# Altium schematic sheet SunS_MCU.SchDoc
size A2
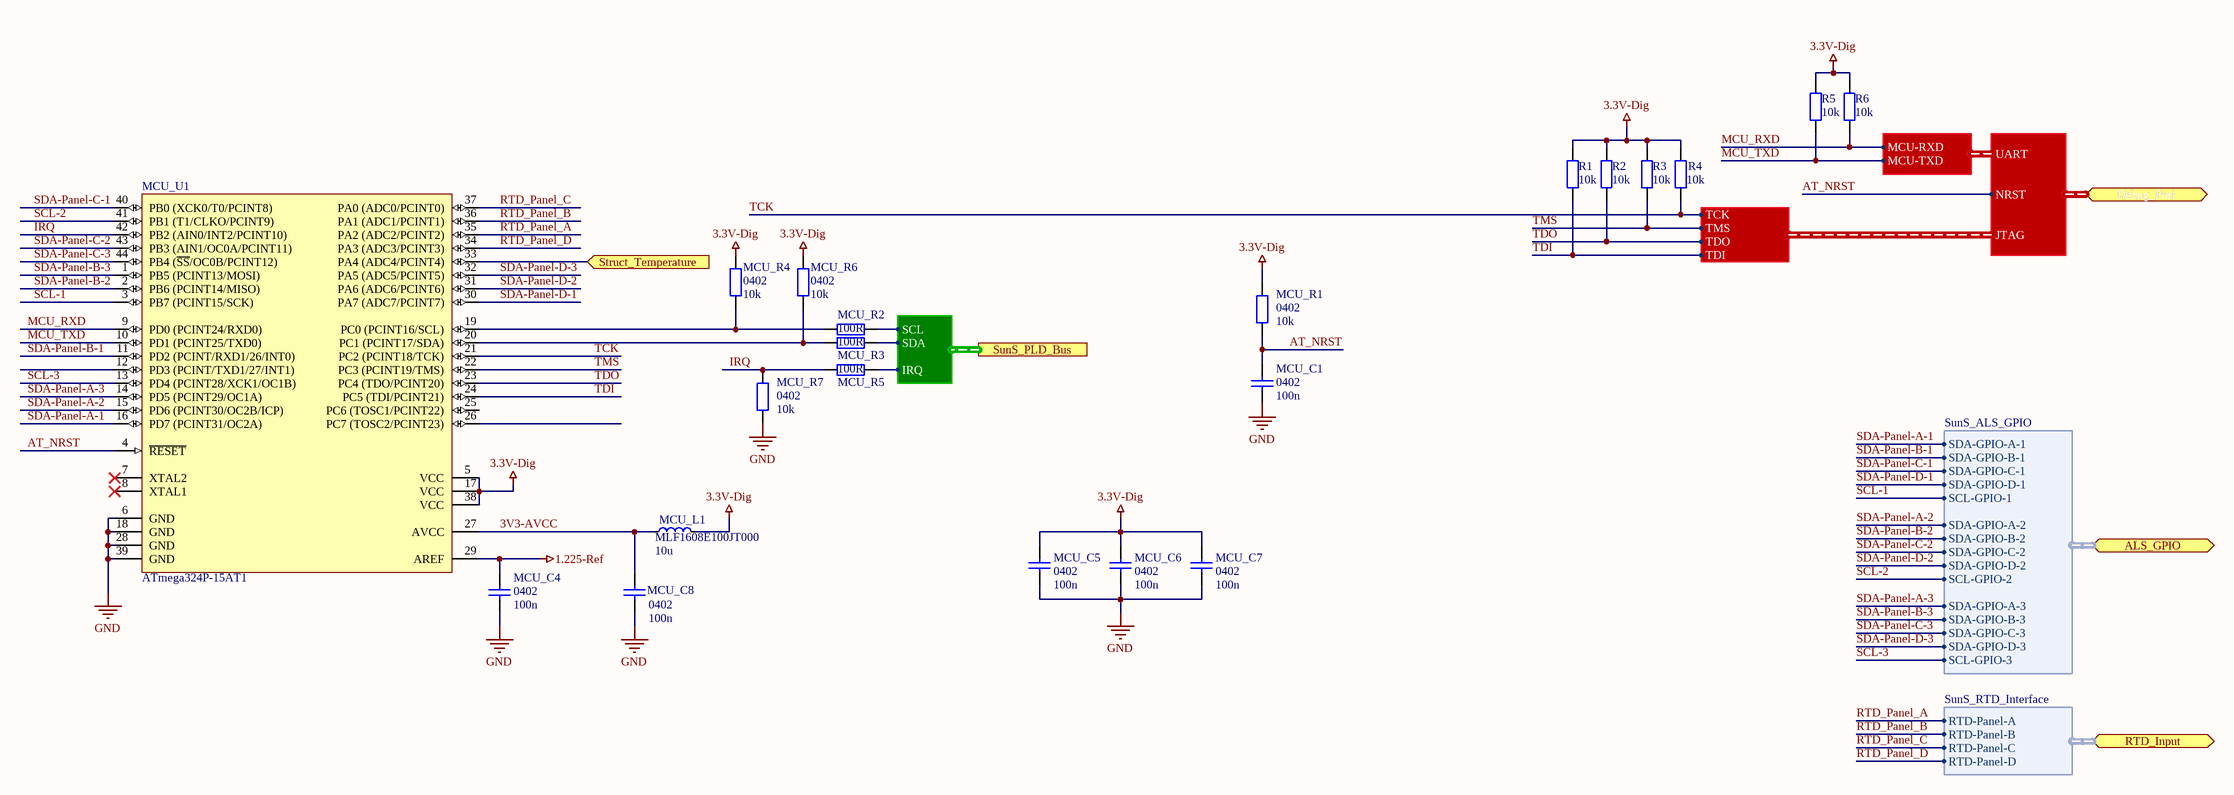
[diagram p0: SunS_MCU.SchDoc]

## Parts
MCU_C1  0402  value 100n  [SMD_Capacitor_0402]
MCU_C4  0402  value 100n  [SMD_Capacitor_0402]
MCU_C5  0402  value 100n  [SMD_Capacitor_0402]
MCU_C6  0402  value 100n  [SMD_Capacitor_0402]
MCU_C7  0402  value 100n  [SMD_Capacitor_0402]
MCU_C8  0402  value 100n  [SMD_Capacitor_0402]
MCU_L1  Manufacturer Part Number: MLF1608E100JT000  [0603]  (hidden comment: 10u)
MCU_R1  0402  value 10k  [SMD_Capacitor_0402]
MCU_R2  100R  [SMD_Resistor_0402]
MCU_R3  100R  [SMD_Resistor_0402]
MCU_R4  0402  value 10k  [SMD_Capacitor_0402]
MCU_R5  100R  [SMD_Resistor_0402]
MCU_R6  0402  value 10k  [SMD_Capacitor_0402]
MCU_R7  0402  value 10k  [SMD_Capacitor_0402]
MCU_U1  ATmega324P-15AT1  [TQFP-44]
R1  10k  [SMD_Resistor_0402]
R2  10k  [SMD_Resistor_0402]
R3  10k  [SMD_Resistor_0402]
R4  10k  [SMD_Resistor_0402]
R5  10k  [SMD_Resistor_0402]
R6  10k  [SMD_Resistor_0402]

## Ports
ALS_GPIO (harness SunS_ALS_GPIO), Debug_Port (harness SunS-Debug-Port), RTD_Input (harness SunS_RTD_Interface), Struct_Temperature (in), SunS_PLD_Bus (harness SunS_PLD_Bus)

## Harnesses
SunS_RTD_Interface: RTD-Panel-A, RTD-Panel-B, RTD-Panel-C, RTD-Panel-D
SunS-UART: MCU-RXD, MCU-TXD
SunS-Debug-Port: NRST, UART, JTAG
SunS_ALS_GPIO: SDA-GPIO-A-1, SDA-GPIO-D-1, SDA-GPIO-B-1, SDA-GPIO-C-1, SCL-GPIO-1, SDA-GPIO-A-2, SDA-GPIO-D-2, SDA-GPIO-B-2, SDA-GPIO-C-2, SCL-GPIO-2, SDA-GPIO-A-3, SDA-GPIO-D-3, SDA-GPIO-B-3, SDA-GPIO-C-3, SCL-GPIO-3
SunS_PLD_Bus: SCL, SDA, IRQ
JTAG: TDO, TDI, TMS, TCK

## Nets
1.225-Ref: MCU_C4.2 MCU_U1.29(AREF)
3.3V-Dig: MCU_C5.2 MCU_C6.2 MCU_C7.2 MCU_L1.2 MCU_R1.2 MCU_R4.2 MCU_R6.2 MCU_U1.5(VCC) MCU_U1.17(VCC) MCU_U1.38(VCC) R1.1 R2.1 R3.1 R4.1 R5.1 R6.1
GND: MCU_C1.1 MCU_C4.1 MCU_C5.1 MCU_C6.1 MCU_C7.1 MCU_C8.1 MCU_R7.1 MCU_U1.6(GND) MCU_U1.18(GND) MCU_U1.28(GND) MCU_U1.39(GND)
3V3-AVCC: MCU_C8.2 MCU_L1.1 MCU_U1.27(AVCC)
AT_NRST: MCU_C1.2 MCU_R1.1 MCU_U1.4(~{RESET}) ; port Debug_Port.NRST
IRQ: MCU_R5.1 MCU_R7.2 MCU_U1.42(PB2_(AIN0/INT2/PCINT10))
MCU_RXD: MCU_U1.9(PD0_(PCINT24/RXD0)) R6.2 ; harness SunS-UART.MCU-RXD
MCU_TXD: MCU_U1.10(PD1_(PCINT25/TXD0)) R5.2 ; harness SunS-UART.MCU-TXD
RTD_Panel_A: MCU_U1.35(PA2_(ADC2/PCINT2)) ; port RTD_Input.RTD-Panel-A
RTD_Panel_B: MCU_U1.36(PA1_(ADC1/PCINT1)) ; port RTD_Input.RTD-Panel-B
RTD_Panel_C: MCU_U1.37(PA0_(ADC0/PCINT0)) ; port RTD_Input.RTD-Panel-C
RTD_Panel_D: MCU_U1.34(PA3_(ADC3/PCINT3)) ; port RTD_Input.RTD-Panel-D
SCL-1: MCU_U1.3(PB7_(PCINT15/SCK)) ; port ALS_GPIO.SCL-GPIO-1
SCL-2: MCU_U1.41(PB1_(T1/CLKO/PCINT9)) ; port ALS_GPIO.SCL-GPIO-2
SCL-3: MCU_U1.13(PD4_(PCINT28/XCK1/OC1B)) ; port ALS_GPIO.SCL-GPIO-3
SDA-Panel-A-1: MCU_U1.16(PD7_(PCINT31/OC2A)) ; port ALS_GPIO.SDA-GPIO-A-1
SDA-Panel-A-2: MCU_U1.15(PD6_(PCINT30/OC2B/ICP)) ; port ALS_GPIO.SDA-GPIO-A-2
SDA-Panel-A-3: MCU_U1.14(PD5_(PCINT29/OC1A)) ; port ALS_GPIO.SDA-GPIO-A-3
SDA-Panel-B-1: MCU_U1.11(PD2_(PCINT/RXD1/26/INT0)) ; port ALS_GPIO.SDA-GPIO-B-1
SDA-Panel-B-2: MCU_U1.2(PB6_(PCINT14/MISO)) ; port ALS_GPIO.SDA-GPIO-B-2
SDA-Panel-B-3: MCU_U1.1(PB5_(PCINT13/MOSI)) ; port ALS_GPIO.SDA-GPIO-B-3
SDA-Panel-C-1: MCU_U1.40(PB0_(XCK0/T0/PCINT8)) ; port ALS_GPIO.SDA-GPIO-C-1
SDA-Panel-C-2: MCU_U1.43(PB3_(AIN1/OC0A/PCINT11)) ; port ALS_GPIO.SDA-GPIO-C-2
SDA-Panel-C-3: MCU_U1.44(PB4_(~{SS}/OC0B/PCINT12)) ; port ALS_GPIO.SDA-GPIO-C-3
SDA-Panel-D-1: MCU_U1.30(PA7_(ADC7/PCINT7)) ; port ALS_GPIO.SDA-GPIO-D-1
SDA-Panel-D-2: MCU_U1.31(PA6_(ADC6/PCINT6)) ; port ALS_GPIO.SDA-GPIO-D-2
SDA-Panel-D-3: MCU_U1.32(PA5_(ADC5/PCINT5)) ; port ALS_GPIO.SDA-GPIO-D-3
Struct_Temperature: MCU_U1.33(PA4_(ADC4/PCINT4)) ; port Struct_Temperature
TCK: MCU_U1.21(PC2_(PCINT18/TCK)) R4.2 ; harness JTAG.TCK
TDI: MCU_U1.24(PC5_(TDI/PCINT21)) R1.2 ; harness JTAG.TDI
TDO: MCU_U1.23(PC4_(TDO/PCINT20)) R2.2 ; harness JTAG.TDO
TMS: MCU_U1.22(PC3_(PCINT19/TMS)) R3.2 ; harness JTAG.TMS
NetMCU_R2_1: MCU_R2.1 MCU_R4.1 MCU_U1.19(PC0_(PCINT16/SCL))
NetMCU_R2_2: MCU_R2.2 ; port SunS_PLD_Bus.SCL
NetMCU_R3_1: MCU_R3.1 MCU_R6.1 MCU_U1.20(PC1_(PCINT17/SDA))
NetMCU_R3_2: MCU_R3.2 ; port SunS_PLD_Bus.SDA
NetMCU_R5_2: MCU_R5.2 ; port SunS_PLD_Bus.IRQ

Not connected (* = marked no-connect by the designer): MCU_U1 7(XTAL2)* 8(XTAL1)* 12(PD3_(PCINT/TXD1/27/INT1)) 25(PC6_(TOSC1/PCINT22)) 26(PC7_(TOSC2/PCINT23))

## Notes on the sheet
- Title:
- Project:
- Author:
- Model:
- File name:
- Document Number:
- Checked by:
- Rev:
- Date:
- Approved by:
- Sheet:
- of

## Library data of the parts
MCU_C1 MCU_C4-MCU_C8 = Cap: Capacitor; Published: 8-Jun-2000; LatestRevisionDate: 17-Jul-2002; LatestRevisionNote: Re-released for DXP Platform.; PackageReference: RAD-0.3; Publisher: Altium Limited; PackageDescription: Radial Cap, Thru-Hole; 2 Leads; 0.3 in Pin Spacing
MCU_L1 = Inductor: Generic Inductor; Manufacturer: TDK; value: 10u
MCU_R1 MCU_R4 MCU_R6 MCU_R7 = Res2: Resistor; Published: 8-Jun-2000; LatestRevisionDate: 17-Jul-2002; LatestRevisionNote: Re-released for DXP Platform.; PackageReference: AXIAL-0.4; Publisher: Altium Limited; PackageDescription: Axial Device, Thru-Hole; 2 Leads; 0.4 in Pin Spacing
MCU_R2 MCU_R3 MCU_R5 = CRCW0402100RFKxxxx: 100R/1% Vishay CRCW 0402 Resistor. 63mW, 100ppm, 50V.; Manufacturer: Vishay; ManufacturerPartNumber: CRCW0402100RFKxxxx; Value: 100R; Package: 0402
MCU_U1 = ATmega324P-15AT1: 8-bit Automotive AVR Microcontroller, 32KB Flash, 1KB EEPROM, 2KB SRAM, Reduced Automotive Grade (-40°C to +105°C), 44-Pin TQFP; DatasheetVersion: revF, Sep-2009; PackageVersion: rev.G, Jul-2007; PackageReference: 44ML; PackageDescription: 44-Pin Plastic Thin Quad Flat Pack, 10 x 10 x 1.0 mm Body, 0.8 mm Pitch (TQFP); ComponentLink1Description: Manufacturer URL; ComponentLink1URL: http://www.atmel.com/; ComponentLink2Description: ATmega164P/324P/644P Datasheet; ComponentLink2URL: http://www.atmel.com/dyn/resources/prod_documents/doc7674.pdf; ComponentLink3Description: ATmega164P/324P/644P Summary; ComponentLink3URL: http://www.atmel.com/dyn/resources/prod_documents/7674S.pdf
R1-R6 = Res: Value: 10k; Package: 0402